# EAGLE design LiFePo4 Charger Single to Chain 2.1 SMD -- Finished (EAGLE 6.2)
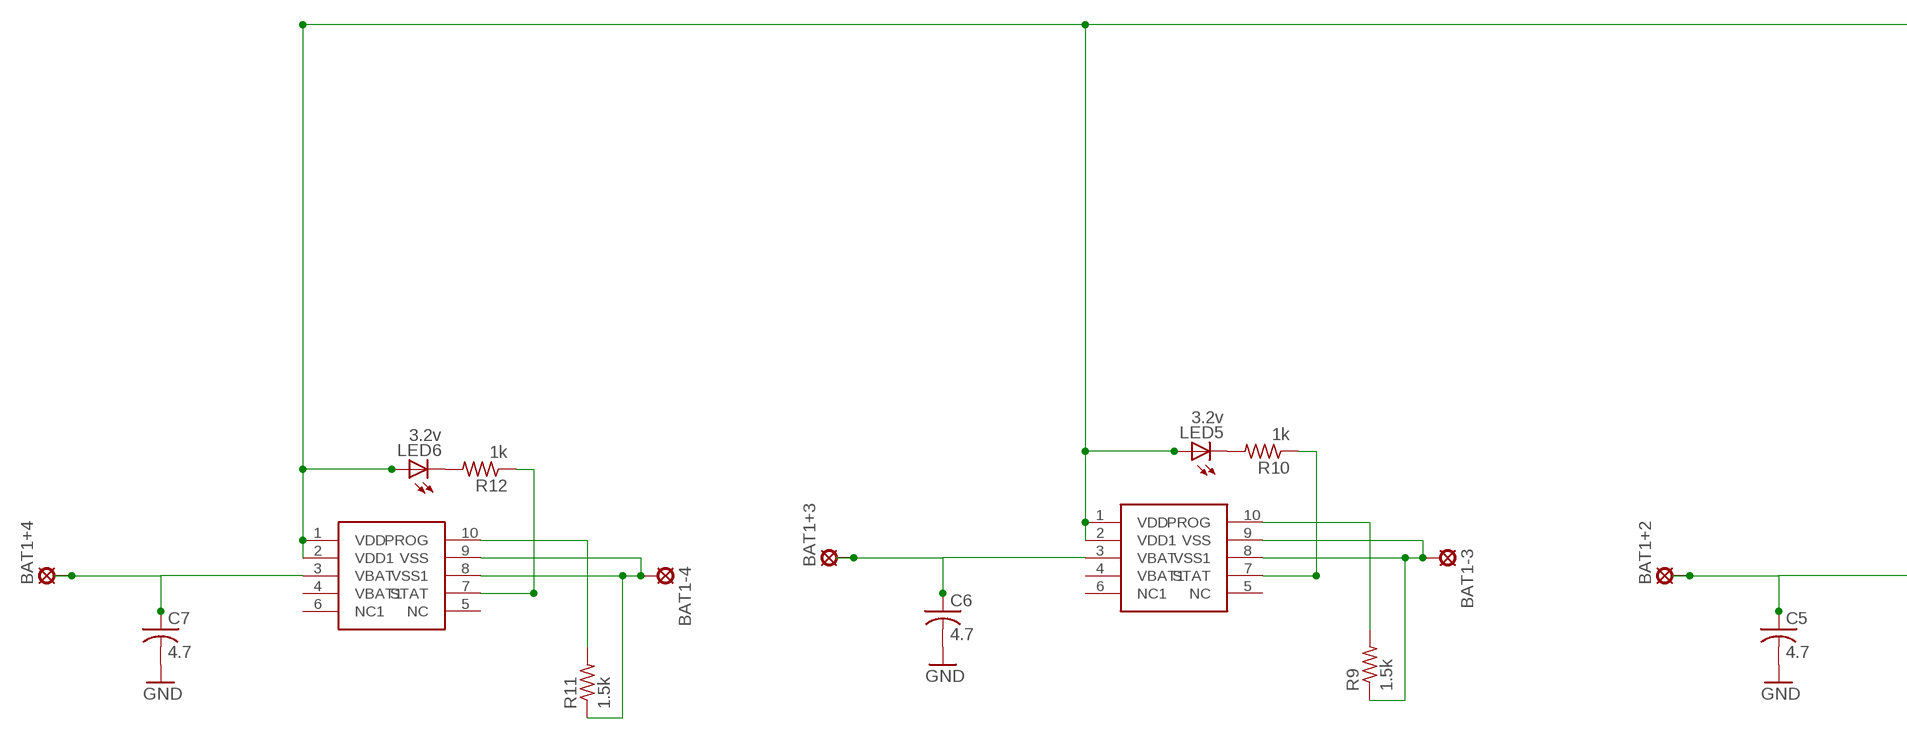
[diagram p0: schematic, sheet 1, part 1 of 2]
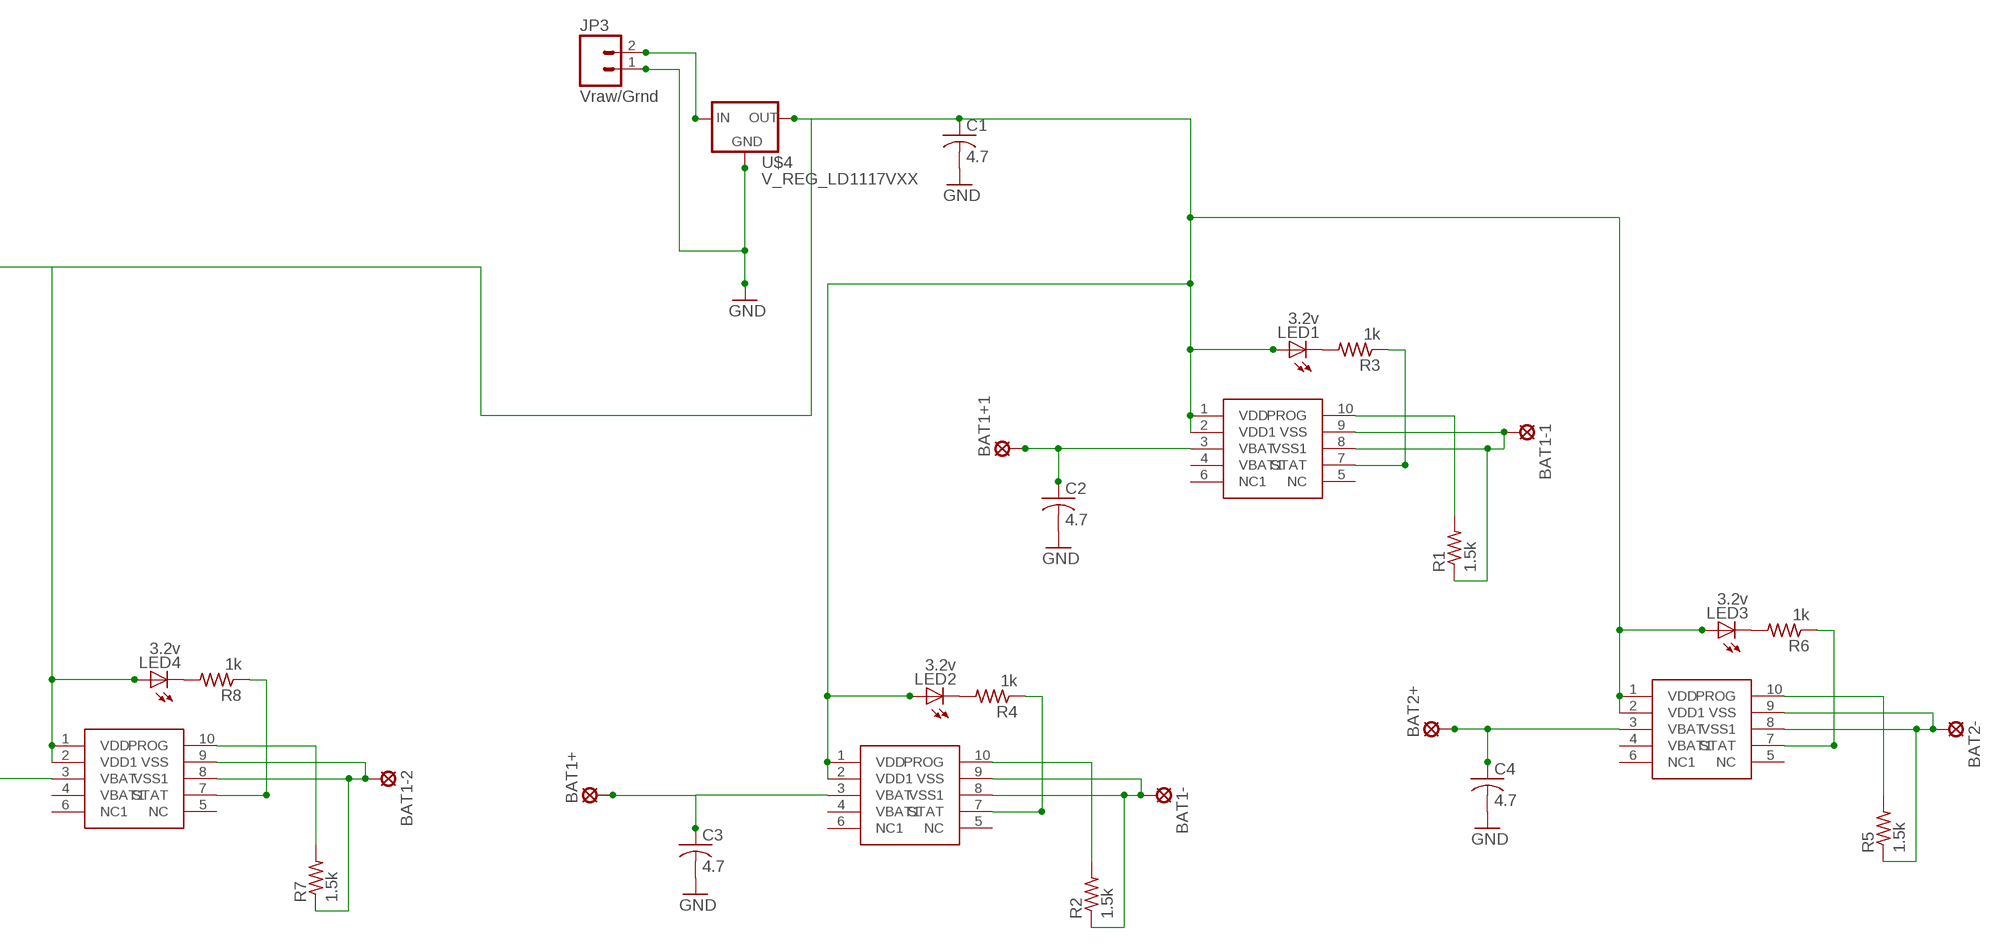
[diagram p1: schematic, sheet 1, part 2 of 2]

## Parts
BAT1+  SE14  [SE14]
BAT1+1  SE14  [SE14]
BAT1+2  SE14  [SE14]
BAT1+3  SE14  [SE14]
BAT1+4  SE14  [SE14]
BAT1-  SE14  [SE14]
BAT1-1  SE14  [SE14]
BAT1-2  SE14  [SE14]
BAT1-3  SE14  [SE14]
BAT1-4  SE14  [SE14]
BAT2+  SE14  [SE14]
BAT2-  SE14  [SE14]
C1  4.7  C-USC0805  [C0805]
C2  4.7  C-USC0805  [C0805]
C3  4.7  C-USC0805  [C0805]
C4  4.7  C-USC0805  [C0805]
C5  4.7  C-USC0805  [C0805]
C6  4.7  C-USC0805  [C0805]
C7  4.7  C-USC0805  [C0805]
JP3  Vraw/Grnd  M02PTH  [1X02]
LED1  3.2v  LEDSML0603  [SML0603]
LED2  3.2v  LEDSML0603  [SML0603]
LED3  3.2v  LEDSML0603  [SML0603]
LED4  3.2v  LEDSML0603  [SML0603]
LED5  3.2v  LEDSML0603  [SML0603]
LED6  3.2v  LEDSML0603  [SML0603]
R1  1.5k  R-US_R0805  [R0805]
R2  1.5k  R-US_R0805  [R0805]
R3  1k  R-US_R0805  [R0805]
R4  1k  R-US_R0805  [R0805]
R5  1.5k  R-US_R0805  [R0805]
R6  1k  R-US_R0805  [R0805]
R7  1.5k  R-US_R0805  [R0805]
R8  1k  R-US_R0805  [R0805]
R9  1.5k  R-US_R0805  [R0805]
R10  1k  R-US_R0805  [R0805]
R11  1.5k  R-US_R0805  [R0805]
R12  1k  R-US_R0805  [R0805]
U$1  MCP73123/223  [MCP73123/223]
U$2  MCP73123/223  [MCP73123/223]
U$3  MCP73123/223  [MCP73123/223]
U$4  V_REG_LD1117VXX  [78XXL]
U$5  MCP73123/223  [MCP73123/223]
U$6  MCP73123/223  [MCP73123/223]
U$8  MCP73123/223  [MCP73123/223]

## Nets
GND: C1.2 C2.2 C3.2 C4.2 C5.2 C6.2 C7.2 JP3.1 U$4.IN(GND)
N$1: JP3.2 U$4.OUT(IN)
N$2: BAT1+2.MP C5.1 U$3.3(VBAT)
N$3: BAT1+1.MP C2.1 U$8.3(VBAT)
N$4: R1.2 U$8.10(PROG)
N$5: BAT1-1.MP R1.1 U$8.8(VSS1) U$8.9(VSS)
N$6: LED1.C R3.2
N$7: R3.1 U$8.7(STAT)
N$8: BAT1+.MP C3.1 U$1.3(VBAT)
N$9: BAT1-.MP R2.1 U$1.8(VSS1) U$1.9(VSS)
N$10: R4.1 U$1.7(STAT)
N$11: R2.2 U$1.10(PROG)
N$12: BAT2+.MP C4.1 U$2.3(VBAT)
N$13: LED2.C R4.2
N$14: BAT2-.MP R5.1 U$2.8(VSS1) U$2.9(VSS)
N$15: R6.1 U$2.7(STAT)
N$16: R5.2 U$2.10(PROG)
N$17: LED3.C R6.2
N$18: C1.1 LED1.A LED2.A LED3.A LED5.A LED6.A U$1.1(VDD) U$1.2(VDD1) U$2.1(VDD) U$2.2(VDD1) U$4.GND(OUT) U$5.1(VDD) U$5.2(VDD1) U$6.1(VDD) U$6.2(VDD1) U$8.1(VDD) U$8.2(VDD1)
N$19: BAT1-2.MP R7.1 U$3.8(VSS1) U$3.9(VSS)
N$20: R8.1 U$3.7(STAT)
N$21: R7.2 U$3.10(PROG)
N$22: LED4.C R8.2
N$23: LED4.A U$3.1(VDD) U$3.2(VDD1)
N$24: BAT1+3.MP C6.1 U$5.3(VBAT)
N$25: BAT1-3.MP R9.1 U$5.8(VSS1) U$5.9(VSS)
N$26: R10.1 U$5.7(STAT)
N$27: R9.2 U$5.10(PROG)
N$28: LED5.C R10.2
N$30: BAT1+4.MP C7.1 U$6.3(VBAT)
N$31: BAT1-4.MP R11.1 U$6.8(VSS1) U$6.9(VSS)
N$32: R12.1 U$6.7(STAT)
N$33: R11.2 U$6.10(PROG)
N$34: LED6.C R12.2
Unconnected: U$1.4(VBAT1) U$1.5(NC) U$1.6(NC1) U$2.4(VBAT1) U$2.5(NC) U$2.6(NC1) U$3.4(VBAT1) U$3.5(NC) U$3.6(NC1) U$5.4(VBAT1) U$5.5(NC) U$5.6(NC1) U$6.4(VBAT1) U$6.5(NC) U$6.6(NC1) U$8.4(VBAT1) U$8.5(NC) U$8.6(NC1)

## Library data of the parts
BAT1+ BAT1+1-BAT1+4 BAT1- BAT1-1-BAT1-4 BAT2+ BAT2- = solpad:SE14: SOLDER PAD E1553, drill 1,4mm, distributor Buerklin, 07F820
C1-C7 = resistor:C-US: CAPACITOR, American symbol
JP3 = SparkFun:M02: Header 2 Standard 2-pin 0.1" header. Use with straight break away headers (SKU : PRT-00116), right angle break away headers (PRT-00553), swiss pins (PRT-00743), machine pins (PRT-00117), and female headers (PRT-00115). Molex polarized connector foot print use with SKU : PRT-08233 with associated crimp pins and housings.
LED1-LED6 = led:LED: LED OSRAM: - CHIPLED LG R971, LG N971, LY N971, LG Q971, LY Q971, LO R971, LY R971 LH N974, LH R974 LS Q976, LO Q976, LY Q976 LO Q996 - Hyper CHIPLED LW Q18S LB Q993, LB Q99A, LB R99A - SideLED LS A670, LO A670, LY A670, LG A670, LP A670 LB A673, LV A673, LT A673, LW A673 LH A674 LY A675 LS A676, LA A676, LO A676, LY A676, LW A676 LS A679, LY A679, LG A679 - Hyper Micro SIDELED® LS Y876, LA Y876, LO Y876, LY Y876 LT Y87S - SmartLED LW L88C, LW L88S LB L89C, LB L89S, LG L890 LS L89K, LO L89K, LY L89K LS L896, LA L896, LO L896, LY L896 - TOPLED LS T670, LO T670, LY T670, LG T670, LP T670 LSG T670, LSP T670, LSY T670, LOP T670, LYG T670 LG T671, LOG T671, LSG T671 LB T673, LV T673, LT T673, LW T673 LH T674 LS T676, LA T676, LO T676, LY T676, LB T676, LH T676, LSB T676, LW T676 LB T67C, LV T67C, LT T67C, LS T67K, LO T67K, LY T67K, LW E67C LS E67B, LA E67B, LO E67B, LY E67B, LB E67C, LV E67C, LT E67C LW T67C LS T679, LY T679, LG T679 LS T770, LO T770, LY T770, LG T770, LP T770 LB T773, LV T773, LT T773, LW T773 LH T774 LS E675, LA E675, LY E675, LS T675 LS T776, LA T776, LO T776, LY T776, LB T776 LHGB T686 LT T68C, LB T68C - Hyper Mini TOPLED® LB M676 - Mini TOPLED Santana® LG M470 LS M47K, LO M47K, LY M47K Source: http://www.osram.convergy.de LUXEON: - LUMILED® LXK2-PW12-R00, LXK2-PW12-S00, LXK2-PW14-U00, LXK2-PW14-V00 LXK2-PM12-R00, LXK2-PM12-S00, LXK2-PM14-U00 LXK2-PE12-Q00, LXK2-PE12-R00, LXK2-PE12-S00, LXK2-PE14-T00, LXK2-PE14-U00 LXK2-PB12-K00, LXK2-PB12-L00, LXK2-PB12-M00, LXK2-PB14-N00, LXK2-PB14-P00, LXK2-PB14-Q00 LXK2-PR12-L00, LXK2-PR12-M00, LXK2-PR14-Q00, LXK2-PR14-R00 LXK2-PD12-Q00, LXK2-PD12-R00, LXK2-PD12-S00 LXK2-PH12-R00, LXK2-PH12-S00 LXK2-PL12-P00, LXK2-PL12-Q00, LXK2-PL12-R00 Source: www.luxeon.com KINGBRIGHT: KA-3528ASYC Source: www.kingbright.com
R1-R12 = resistor:R-US_: RESISTOR, American symbol
U$1-U$3 U$5 U$6 U$8 = untitled:MCP73123/223
U$4 = SparkFun:V_REG_LD1117VXX: LD1117VXX voltage regulator. We carry the 3.3V version (COM-00526) in TO-220 package.

## Board
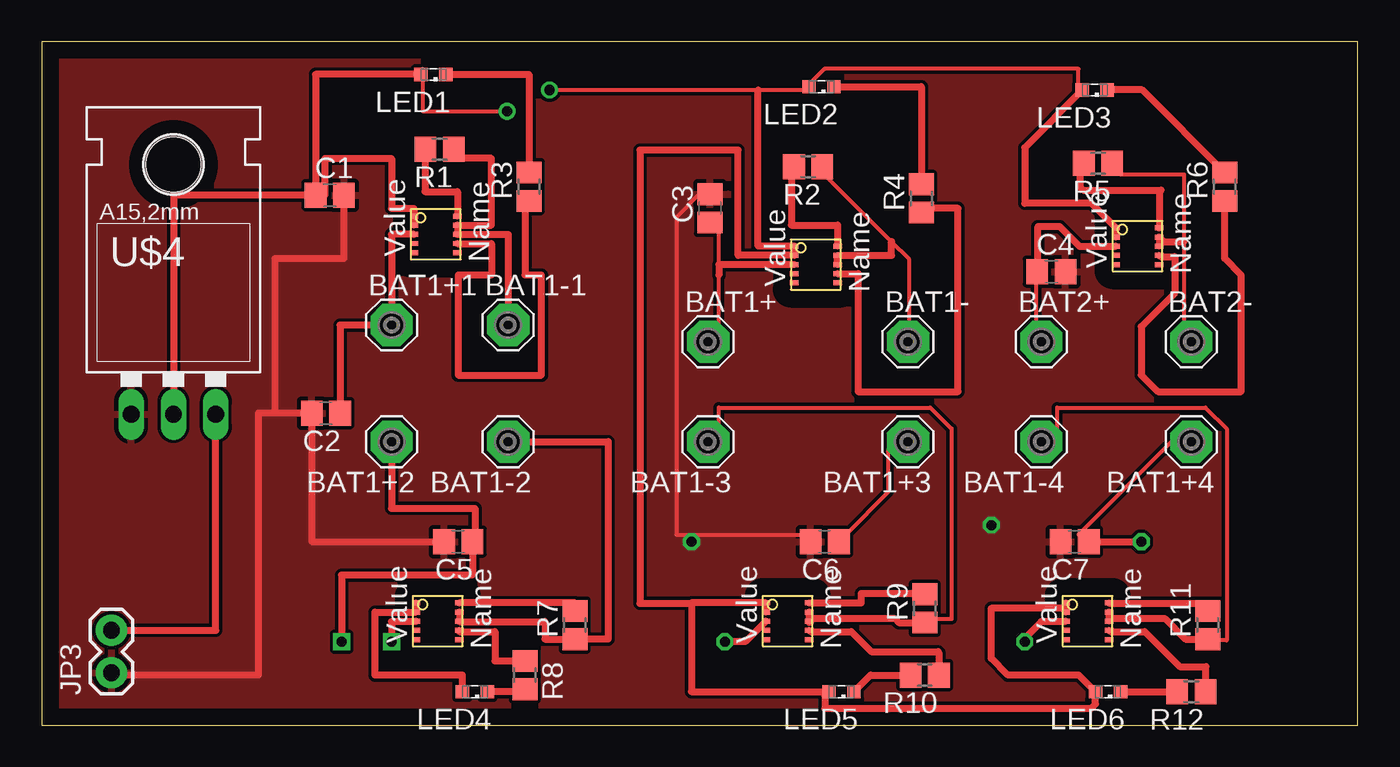
[diagram p2: board, top side]
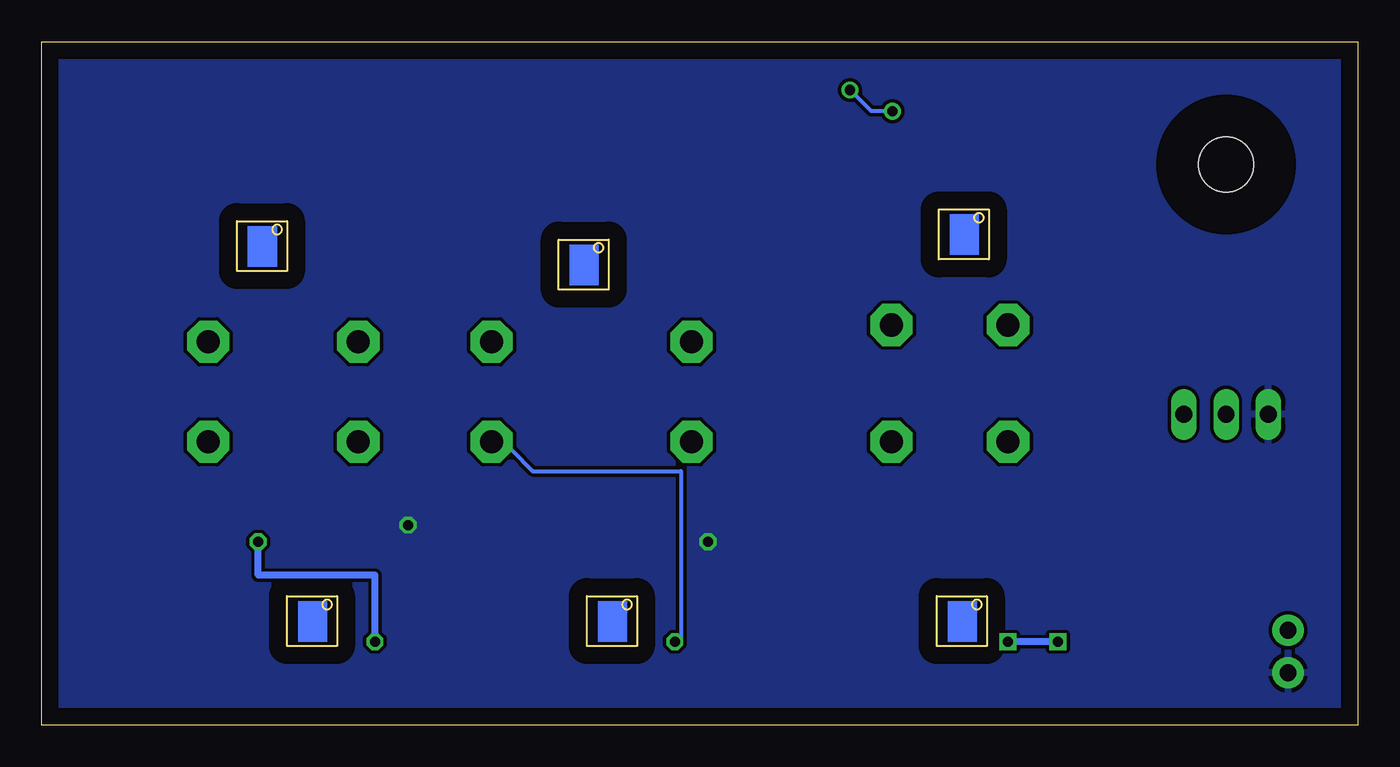
[diagram p3: board, bottom side, seen from below]

Size 79 x 41 mm. Coordinates in mm from the lower left corner, seen from the top.
Outline: 0,0 79,0 79,41 0,41 0,0
Copper layers (1*16): Top 0.035mm / dielectric 1.5mm / Bottom 0.035mm
Design rules: minimum track width 10mil, minimum drill 24mil, track to track 8mil, track to pad 8mil, pad to pad 8mil, via to via 8mil, smd to smd 8mil, copper to edge 40mil, drill to drill 8mil, minimum pad ring 10mil, minimum via ring 8mil, stop-mask expansion 4mil, vias tented up to drill 0mil, thermal gap 10mil

### Footprints (pad centres in the part's own frame; a part is rotated, then mirrored left to right if it is on the bottom)
SE14 = drill 1.397 pad 2.54 octagon: MP 0,0
C0805 = smd 1.3 x 1.5: 1 -0.85,0; 2 0.85,0
1X02 = drill 1.016 pad 1.88: 1 0,0; 2 2.54,0
SML0603 = smd 0.8 x 0.8: A 0.75,0; C -0.75,0
R0805 = smd 1.3 x 1.5: 1 -0.85,0; 2 0.85,0
MCP73123/223 = smd 0.5 x 0.3: 1 1.47,-1.67; 2 1.47,-2.22; 3 1.47,-2.77; 4 1.47,-3.32; 5 1.47,-3.87; 6 4.07,-3.87; 7 4.07,-3.32; 8 4.07,-2.77; 9 4.07,-2.22; 10 4.07,-1.67
78XXL = drill 1.016 long: GND 0,-3.81; IN -2.54,-3.81; OUT 2.54,-3.81 | hole 3.302: 0,11.176

### Placement (x,y rotation side)
BAT1+  40,23 0 top
BAT1+1  21,24 0 top
BAT1+2  21,17 180 top
BAT1+3  52,17 180 top
BAT1+4  69,17 180 top
BAT1-  52,23 0 top
BAT1-1  28,24 0 top
BAT1-2  28,17 180 top
BAT1-3  40,17 180 top
BAT1-4  60,17 180 top
BAT2+  60,23 0 top
BAT2-  69,23 0 top
C1  17.29,31.79 0 top
C2  17.06,18.71 180 top
C3  40.1,31 90 top
C4  60.6,27.2 0 top
C5  25,11 180 top
C6  47,11 180 top
C7  62,11 180 top
JP3  4.19,3.14 90 top
LED1  23.51,39.03 180 top
LED2  46.8,38.3 180 top
LED3  63.2,38.1 180 top
LED4  26,2 180 top
LED5  48,2 180 top
LED6  64,2 180 top
R1  23.88,34.55 180 top
R2  46,33.5 180 top
R3  29.25,32.3 90 top
R4  52.8,31.6 90 top
R5  63.4,33.7 180 top
R6  71,32.3 90 top
R7  32,6 90 top
R8  29,3 270 top
R9  53,7 90 top
R10  53,3 180 top
R11  70,6 90 top
R12  69,2 180 top
U$1  43.7,30.4 0 top
U$2  63,31.5 0 top
U$3  21,9 0 top
U$4  7.91,22.45 0 top
U$5  42,9 0 top
U$6  60,9 0 top
U$8  20.88,32.21 0 top

### Tracks (layer width: path | path; a pad name or v marks a point on that pad's centre or on a via)
GND  (via drill 0.6)
  Top 0.254: C6.2 45.72,11.43 38.1,11.43 38.1,30.48 39.37,31.75 C3.2
  Top 0.406: 14,18.71 C2.2 16.21,11 C5.2 | 14,18.71 14,28 18.14,28 C1.2 | 14,18.71 13,18.71 13,3 4.19,3 JP3.1
  other vias: 39,11 57,12
  pour Bottom: 0,0 0,41 79,41 79,0
  pour Top: 0,0 0,41 79,41 79,0
N$1
  Top 0.406: JP3.2 10.45,5.68 U$4.OUT
N$2  (via drill 0.6)  (1 unrouted)
  Top 0.406: BAT1+2.MP 21,13 26,13 26,11 C5.1 25.85,9 18,9 v18,5 | U$3.3 22.47,6.2 21,6.2 21,5
  Bottom 0.406: v18,5 21,5
N$3
  Top 0.406: U$8.3 21,29.44 BAT1+1.MP 17.91,24 C2.1
N$4
  Top 0.406: R1.2 23,34.55 23,32 24.95,32 U$8.10
N$5
  Top 0.406: BAT1-1.MP 28,29.44 U$8.8 U$8.9 27,29.99 27,34 24.73,34 R1.1
N$6
  Top 0.406: LED1.C 29.25,39.03 R3.2
N$7
  Top 0.406: R3.1 29,31.45 29,27 30,27 30,21 25,21 25,27 27,27 27,28.89 U$8.7
N$8
  Top 0.254: C3.1 40.64,30.48 40.64,27 40.64,24.13 BAT1+.MP
  Top 0.406: U$1.3 40.64,27.63 40.64,27
N$9
  Top 0.254: R2.1 46.99,33.02 51.01,29 52.07,27.94 52.07,24.13 BAT1-.MP
  Top 0.406: U$1.8 U$1.9 51.01,28.18 51.01,29
N$10
  Top 0.406: U$1.7 49,27.08 49,20 55,20 55,31 52.8,31 R4.1
N$11
  Top 0.406: R2.2 45,33.5 45,30 47.77,30 U$1.10
N$12
  Top 0.254: C4.1 59.69,26.67 59.69,24.13 BAT2+.MP
  Top 0.406: C4.1 59.8,27.25 59.8,29.9 61.1,29.9 62.3,28.7 64.44,28.7 U$2.3
N$13
  Top 0.406: LED2.C 52.8,38.3 R4.2
N$14
  Top 0.254: R5.1 64.77,33.02 68.58,33.02 68.58,29 68.58,24.13 BAT2-.MP
  Top 0.406: U$2.8 U$2.9 67.35,29 68.58,29
N$15
  Top 0.406: U$2.7 67.15,28.1 68,28.1 68,25.9 66,23.9 66,21 67,20 72,20 72,27 71,28 R6.1
N$16
  Top 0.406: R5.2 62.3,33.45 62.3,32.3 62.5,32.1 67.2,32.1 67.07,31.97 U$2.10
N$17
  Top 0.406: R6.2 66.05,38.1 LED3.C
N$18  (via drill 0.61)
  Top 0.254: 45.72,38.1 46.99,39.37 62.23,39.37 62.23,38.1 LED3.A | v30.48,38.1 43,38.1 45.72,38.1 | v27.94,36.83 22.86,36.83 22.86,39.37 LED1.A | 45.72,38.1 LED2.A
  Top 0.406: LED1.A 16.44,39.03 C1.1 | C1.1 17,31.79 17,34 21,34 21,31 22.35,31 U$8.1 U$8.2 | C1.1 7.91,31.79 U$4.GND | 43,38.1 43,28.73 U$1.1 U$1.2 41.8,28.18 41.8,34.5 35.9,34.5 35.9,7.3 39,7.3 | U$5.2 U$5.1 39,7.33 39,7.3 | 39,7.3 39,2 LED5.A 47,1.75 47,1 63,1 63.25,1.25 LED6.A 62.25,3 58,3 57,4 57,7 61.25,7 U$6.2 U$6.1 | U$2.2 U$2.1 63,31.3 59,31.3 59,34.65 LED3.A
  Bottom 0.254: v30.48,38.1 29.21,36.83 v27.94,36.83
N$19
  Top 0.406: BAT1-2.MP 34,17 34,5.15 R7.1 30.2,5.15 30.2,6.2 25.07,6.2 U$3.8 U$3.9
N$20
  Top 0.406: U$3.7 25.07,5.6 27.2,5.6 27.2,3.85 R8.1
N$21
  Top 0.406: R7.2 32,7.33 U$3.10
N$22
  Top 0.406: R8.2 29,2 LED4.C
N$23
  Top 0.406: LED4.A 25.25,3 20,3 20,6.78 U$3.2 U$3.1
N$24  (via drill 0.6)
  Top 0.254: C6.1 48.26,11.43 50.8,13.97 50.8,16.51 BAT1+3.MP
  Top 0.406: U$5.3 42.24,5 v41,5
  Bottom 0.254: v41,5 40.64,5.08 40.64,15.24 49.53,15.24 50.8,16.51 BAT1+3.MP
N$25
  Top 0.254: R9.1 53.34,6.35 54.61,6.35 54.61,17.78 53.34,19.05 40.64,19.05 40.64,17.78 BAT1-3.MP
  Top 0.406: U$5.9 U$5.8 46.07,6.15 46.32,6.4 51.2,6.4 51.45,6.15 R9.1
N$26
  Top 0.406: U$5.7 46.15,5.6 48.6,5.6 49.8,4.4 53.8,4.4 53.85,4.35 R10.1
N$27
  Top 0.406: U$5.10 49.2,7.33 49.2,7.9 53,7.9 R9.2
N$28
  Top 0.406: LED5.C 49.75,3 R10.2
N$29  (via drill 0.6)
  other vias: 21,5
N$30  (via drill 0.6)
  Top 0.254: C7.1 62.23,11.43 68.58,17.78 BAT1+4.MP
  Top 0.406: U$6.3 61.44,6.2 60,6.2 59,5.2 v59,5 | C7.1 v66,11
  Bottom 0.406: v59,5 59,9 66,9 v66,11
N$31
  Top 0.254: R11.1 69.85,5.08 71.12,5.08 71.12,17.78 69.85,19.05 60.96,19.05 60.96,17.78 BAT1-4.MP
  Top 0.406: U$6.9 U$6.8 64.24,6.4 67.4,6.4 68.65,5.15 R11.1
N$32
  Top 0.406: U$6.7 64.15,5.6 66.2,5.6 68.3,3.5 69.9,3.5 69.85,3.45 R12.1
N$33
  Top 0.406: U$6.10 64.1,7.3 69.7,7.3 70,7 R11.2
N$34
  Top 0.406: LED6.C R12.2